# EAGLE design MoteWatch Vers 2 (EAGLE 6.1)
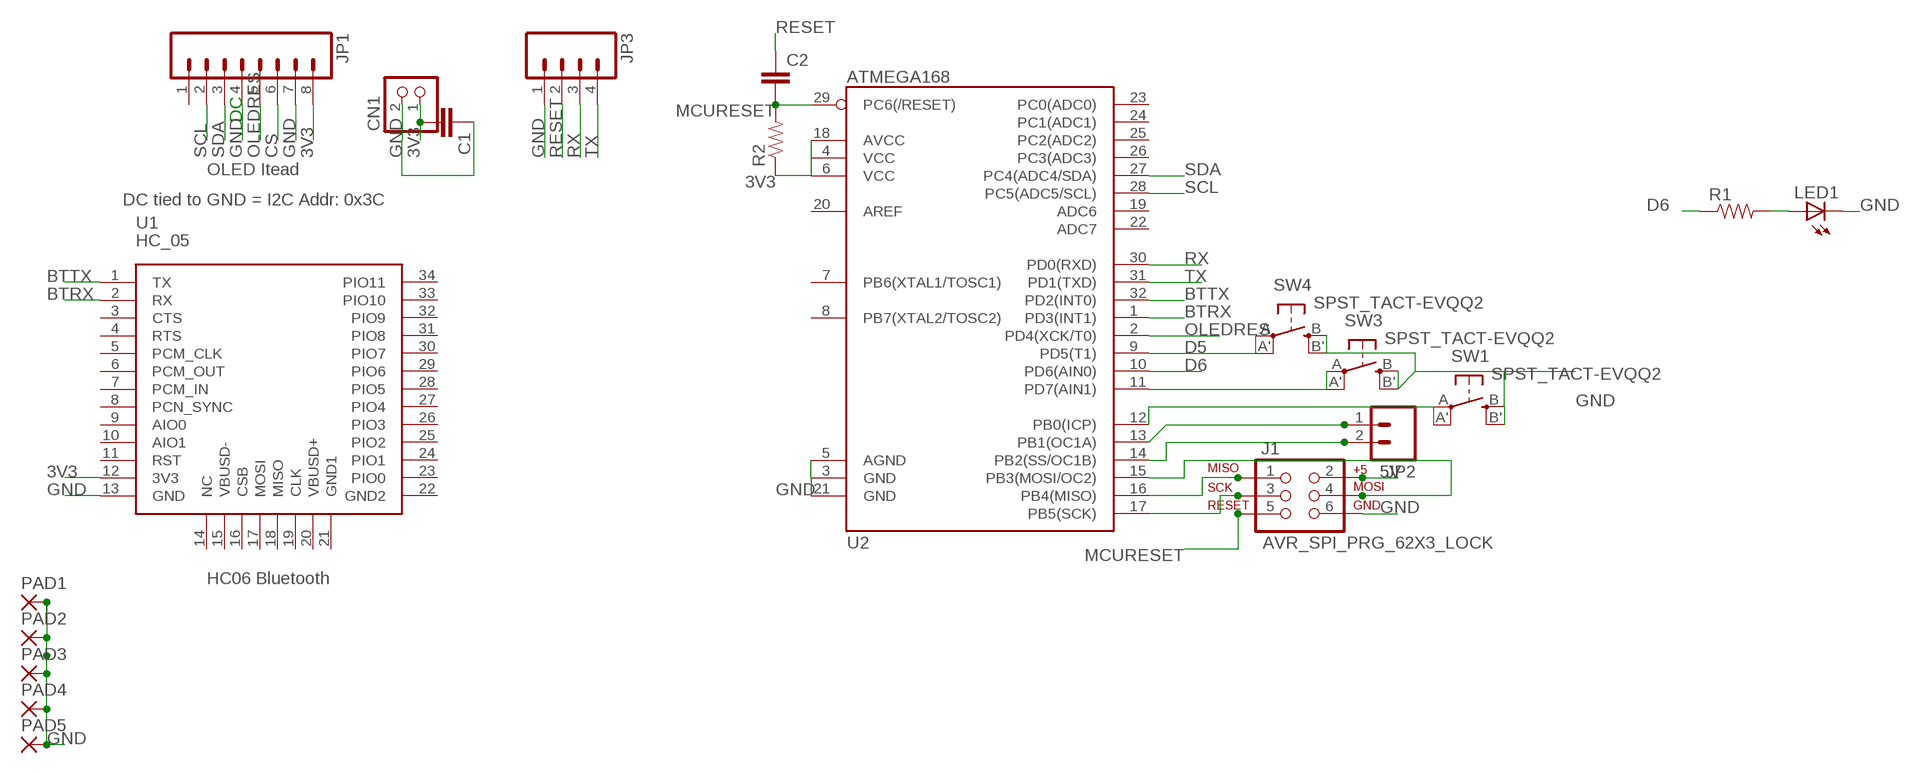
[diagram p0: schematic, sheet 1]

## Parts
C1  CAP1206  [1206]
C2  CAP1206  [1206]
CN1  JST_2PIN-THM-RA  [JST-PH-2-THM-RA]
J1  AVR_SPI_PRG_62X3_LOCK  [2X3_LOCK]
JP1  M08LOCK  [1X08_LOCK]
JP2  M02LOCK  [1X02_LOCK]
JP3  M04PTH  [1X04]
LED1  LED1206  [LED-1206]
PAD1  SMD5  [SMD2,54-5,08]
PAD2  SMD5  [SMD2,54-5,08]
PAD3  SMD5  [SMD2,54-5,08]
PAD4  SMD5  [SMD2,54-5,08]
PAD5  SMD5  [SMD2,54-5,08]
R1  RESISTOR1206  [1206]
R2  RESISTOR1206  [1206]
SW1  SPST_TACT-EVQQ2  [EVQ-Q2]
SW3  SPST_TACT-EVQQ2  [EVQ-Q2]
SW4  SPST_TACT-EVQQ2  [EVQ-Q2]
U1  HC_05  [BLUETOOTH_SMD]
U2  ATMEGA168  [TQFP32-08]

## Nets
3V3: C1.2 CN1.1 JP1.8 R2.1 U1.12(3V3) U2.4(VCC) U2.6(VCC) U2.18(AVCC)
5V: J1.2
BTRX: U1.2(RX) U2.1(PD3(INT1))
BTTX: U1.1(TX) U2.32(PD2(INT0))
CS: JP1.6
D5: SW4.A'(P1) SW4.A(P) U2.9(PD5(T1))
D6: R1.1 U2.10(PD6(AIN0))
D7: SW3.A'(P1) SW3.A(P) U2.11(PD7(AIN1))
D8: SW1.A'(P1) SW1.A(P) U2.12(PB0(ICP))
D9: JP2.1 U2.13(PB1(OC1A))
D10: JP2.2 U2.14(PB2(SS/OC1B))
GND: C1.1 CN1.2 J1.6 JP1.4 JP1.7 JP3.1 LED1.C PAD1.1(P) PAD2.1(P) PAD3.1(P) PAD4.1(P) PAD5.1(P) SW1.B'(S1) SW1.B(S) SW3.B'(S1) SW3.B(S) SW4.B'(S1) SW4.B(S) U1.13(GND) U2.3(GND) U2.5(AGND) U2.21(GND)
MCURESET: C2.2 J1.5 R2.2 U2.29(PC6(/RESET))
MISO: J1.1 U2.16(PB4(MISO))
MOSI: J1.4 U2.15(PB3(MOSI/OC2))
N$2: LED1.A R1.2
OLEDRES: JP1.5 U2.2(PD4(XCK/T0))
RESET: C2.1 JP3.2
RX: JP3.3 U2.30(PD0(RXD))
SCK: J1.3 U2.17(PB5(SCK))
SCL: JP1.2 U2.28(PC5(ADC5/SCL))
SDA: JP1.3 U2.27(PC4(ADC4/SDA))
TX: JP3.4 U2.31(PD1(TXD))
Unconnected: JP1.1 U1.3(CTS) U1.4(RTS) U1.5(PCM_CLK) U1.6(PCM_OUT) U1.7(PCM_IN) U1.8(PCN_SYNC) U1.9(AIO0) U1.10(AIO1) U1.11(RST) U1.14(NC) U1.15(VBUSD-) U1.16(CSB) U1.17(MOSI) U1.18(MISO) U1.19(CLK) U1.20(VBUSD+) U1.21(GND1) U1.22(GND2) U1.23(PIO0) U1.24(PIO1) U1.25(PIO2) U1.26(PIO3) U1.27(PIO4) U1.28(PIO5) U1.29(PIO6) U1.30(PIO7) U1.31(PIO8) U1.32(PIO9) U1.33(PIO10) U1.34(PIO11) U2.7(PB6(XTAL1/TOSC1)) U2.8(PB7(XTAL2/TOSC2)) U2.19(ADC6) U2.20(AREF) U2.22(ADC7) U2.23(PC0(ADC0)) U2.24(PC1(ADC1)) U2.25(PC2(ADC2)) U2.26(PC3(ADC3))

## Notes on the sheet
- DC
- OLED Itead
- DC tied to GND = I2C Addr: 0x3C
- HC06 Bluetooth

## Library data of the parts
C1 C2 = SparkFun-Passives:CAP: Capacitor Standard 0603 ceramic capacitor, and 0.1" leaded capacitor.
CN1 = adafruit:JST_2PIN: JST 2-Pin Connectors of various flavors SMT-RA (S2B-PH-SM4) 4UConnector #17311 SMT (B2B-PH-SM4) THM-RA (S2B-PH) THM (B2B-PH)
J1 = SparkFun-Connectors:AVR_SPI_PRG_6: AVR ISP 6 Pin This is the reduced ISP connector for AVR programming. Common on Arduino. This footprint will take up less PCB space and can be used with a 10-pin to 6-pin adapter such as SKU: BOB-08508
JP1 = SparkFun-Connectors:M08: Header 8 Standard 8-pin 0.1" header. Use with straight break away headers (SKU : PRT-00116), right angle break away headers (PRT-00553), swiss pins (PRT-00743), machine pins (PRT-00117), and female headers (PRT-00115).
JP2 = SparkFun-Connectors:M02: Header 2 Standard 2-pin 0.1" header. Use with straight break away headers (SKU : PRT-00116), right angle break away headers (PRT-00553), swiss pins (PRT-00743), machine pins (PRT-00117), and female headers (PRT-00115). Molex polarized connector foot print use with SKU : PRT-08233 with associated crimp pins and housings.
JP3 = SparkFun-Connectors:M04: Header 4 Standard 4-pin 0.1" header. Use with straight break away headers (SKU : PRT-00116), right angle break away headers (PRT-00553), swiss pins (PRT-00743), machine pins (PRT-00117), and female headers (PRT-00115). Molex polarized connector foot print use with SKU : PRT-08231 with associated crimp pins and housings. 1MM SMD Version SKU: PRT-10208
LED1 = LilyPad-Wearables:LED: LEDs Standard schematic elements and footprints for 5mm, 3mm, 1206, and 0603 sized LEDs. 5mm - Spark Fun Electronics SKU : Comp-SBL
PAD1-PAD5 = wirepad:SMD5: SMD PAD
R1 R2 = SparkFun-Passives:RESISTOR: Resistor Basic schematic elements and footprints for 0603, 1206, and PTH resistors.
SW1 SW3 SW4 = adafruit:SPST_TACT: SMT 6mm switch, EVQQ2 series http://www.ladyada.net/library/eagle
U1 = SerialPortBluetooth:HC_05
U2 = SparkFun-DigitalIC:ATMEGA168: Atmel 32-pin 8-bit micro, 16k flash.

## Board
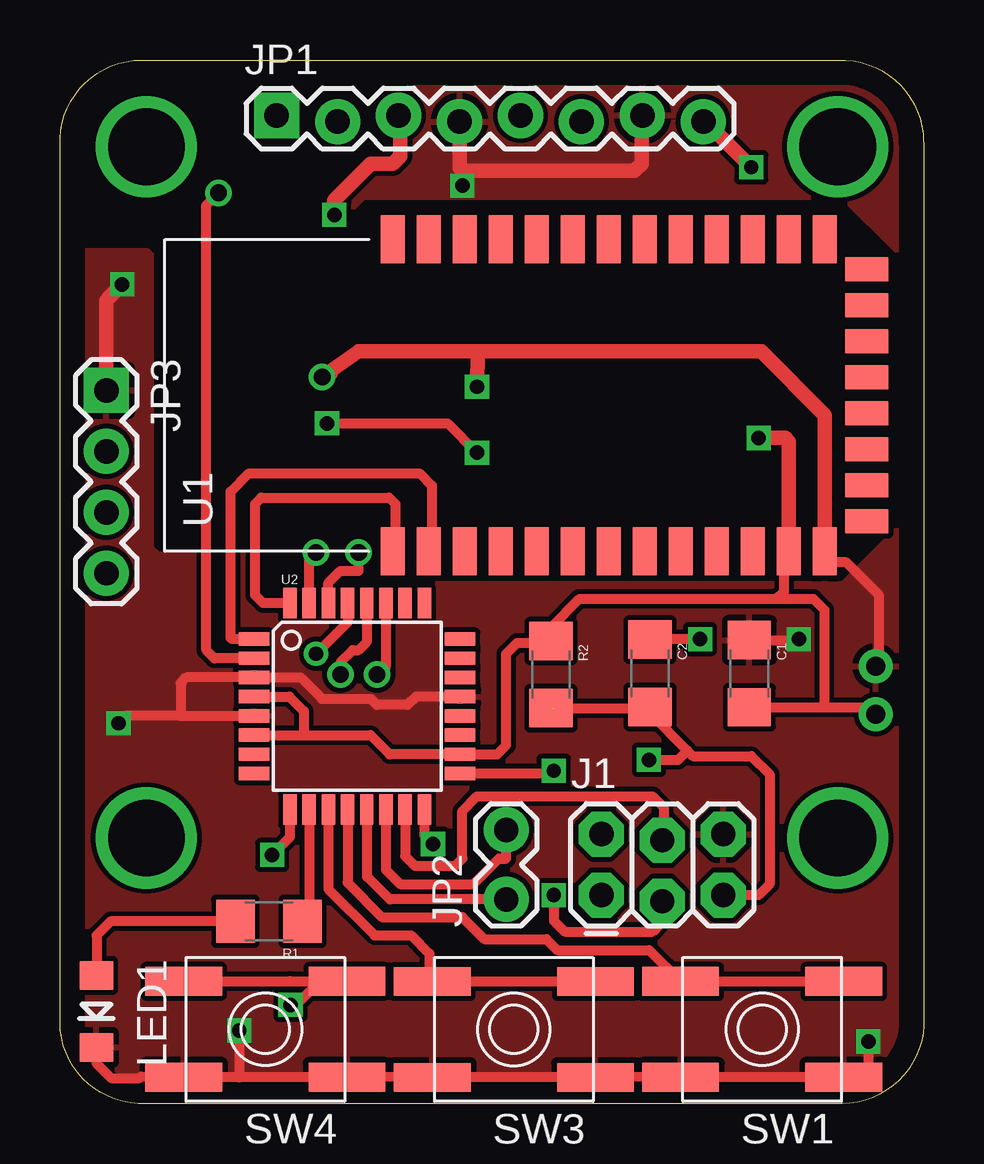
[diagram p1: board, top side]
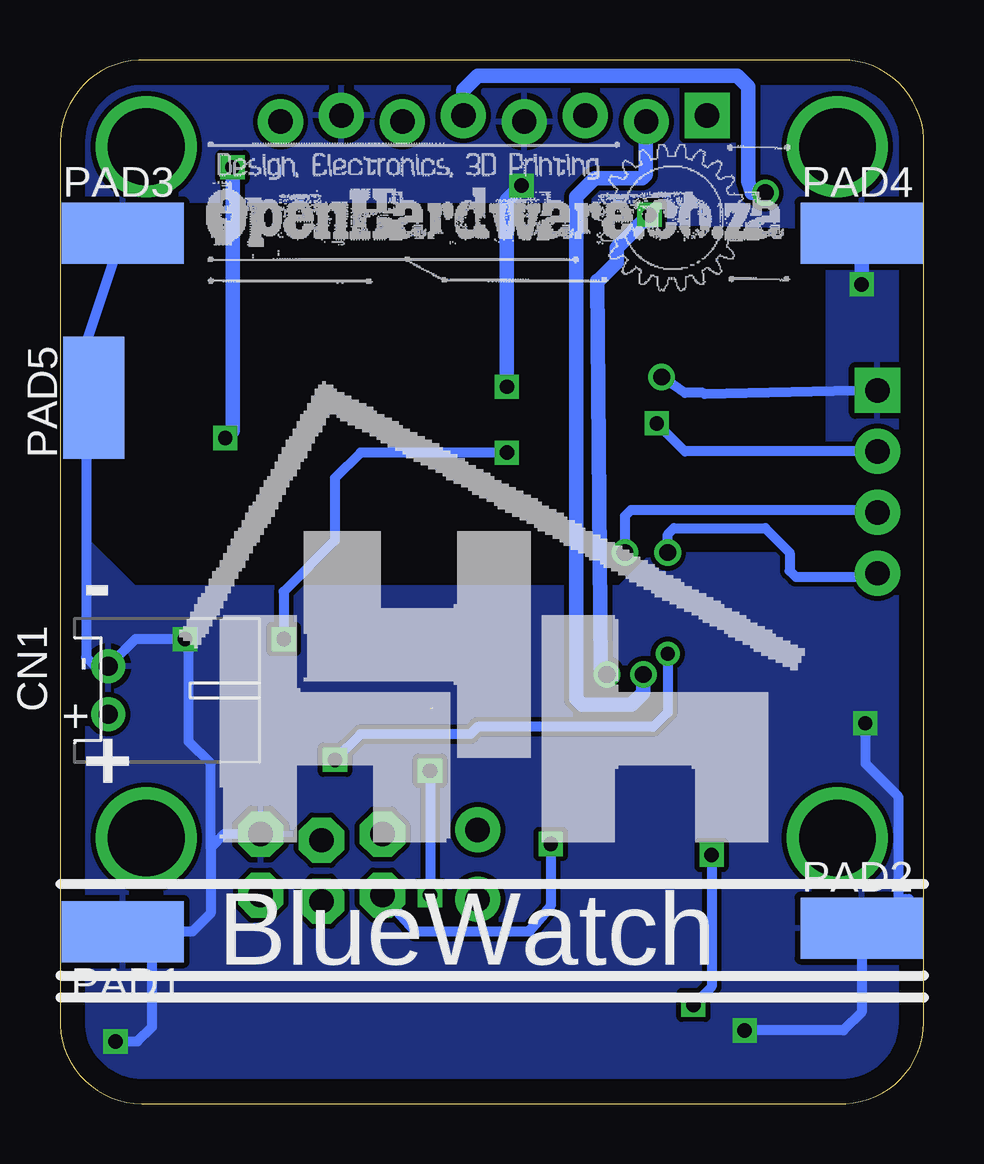
[diagram p2: board, bottom side, seen from below]

Size 35.99 x 43.49 mm. Coordinates in mm from the lower left corner, seen from the top.
Outline: 0,39.9 arc-92 3.4,43.49 32.41,43.49
Outline: 0,39.93 0,3.38 arc92 3.58,0 32.59,0 arc92 35.99,3.58 35.99,40.06
Outline: 32.39,43.48 arc-92 35.98,40.08
Copper layers (1*16): Top 0.035mm / dielectric 1.5mm / Bottom 0.035mm
Design rules "default": minimum track width 10mil, minimum drill 24mil, track to track 8mil, track to pad 8mil, pad to pad 8mil, via to via 8mil, smd to smd 8mil, copper to edge 40mil, drill to drill 8mil, minimum pad ring 10mil, minimum via ring 8mil, stop-mask expansion 4mil, vias tented up to drill 0mil, thermal gap 10mil

### Footprints (pad centres in the part's own frame; a part is rotated, then mirrored left to right if it is on the bottom)
1206 = smd 1.6 x 1.8: 1 -1.4,0; 2 1.4,0
JST-PH-2-THM-RA = drill 0.8 pad 1.422: 1 1,0; 2 -1,0
2X3_LOCK = drill 1.016 pad 1.88 octagon: 1 0,0; 2 0,2.54; 3 2.54,-0.254; 4 2.54,2.286; 5 5.08,0; 6 5.08,2.54
1X08_LOCK = drill 1.016 pad 1.88 square: 1 0,0.127 | drill 1.016 pad 1.88: 2 2.54,-0.127; 3 5.08,0.127; 4 7.62,-0.127; 5 10.16,0.127; 6 12.7,-0.127; 7 15.24,0.127; 8 17.78,-0.127
1X02_LOCK = drill 1.016 pad 1.88: 1 -0.178,0; 2 2.718,0
1X04 = drill 1.016 pad 1.88 square: 1 0,0 | drill 1.016 pad 1.88: 2 2.54,0; 3 5.08,0; 4 7.62,0
LED-1206 = smd 1.2 x 1.4: A -1.5,0; C 1.5,0
SMD2,54-5,08 = smd 2.54 x 5.08: 1 0,0
EVQ-Q2 = smd 3.2 x 1.2: A -3.4,-2; A' 3.4,-2; B -3.4,2; B' 3.4,2
BLUETOOTH_SMD = smd 2 x 1: 1 0,0; 2 0,-1.5; 3 0,-3; 4 0,-4.5; 5 0,-6; 6 0,-7.5; 7 0,-9; 8 0,-10.5; 9 0,-12; 10 0,-13.5; 11 0,-15; 12 0,-16.5; 13 0,-18; 22 13,-18; 23 13,-16.5; 24 13,-15; 25 13,-13.5; 26 13,-12; 27 13,-10.5; 28 13,-9; 29 13,-7.5; 30 13,-6; 31 13,-4.5; 32 13,-3; 33 13,-1.5; 34 13,0 | smd 1 x 1.8: 14 1.25,-19.75; 15 2.75,-19.75; 16 4.25,-19.75; 17 5.75,-19.75; 18 7.25,-19.75; 19 8.75,-19.75; 20 10.25,-19.75; 21 11.75,-19.75
TQFP32-08 = smd 1.27 x 0.559: 1 -4.293,2.8; 2 -4.293,2; 3 -4.293,1.2; 4 -4.293,0.4; 5 -4.293,-0.4; 6 -4.293,-1.2; 7 -4.293,-2; 8 -4.293,-2.8; 17 4.293,-2.8; 18 4.293,-2; 19 4.293,-1.2; 20 4.293,-0.4; 21 4.293,0.4; 22 4.293,1.2; 23 4.293,2; 24 4.293,2.8 | smd 0.559 x 1.27: 9 -2.8,-4.293; 10 -2,-4.293; 11 -1.2,-4.293; 12 -0.4,-4.293; 13 0.4,-4.293; 14 1.2,-4.293; 15 2,-4.293; 16 2.8,-4.293; 25 2.8,4.293; 26 2,4.293; 27 1.2,4.293; 28 0.4,4.293; 29 -0.4,4.293; 30 -1.2,4.293; 31 -2,4.293; 32 -2.8,4.293

### Placement (x,y rotation side)
C1  28.72,17.92 270 top
C2  24.59,17.93 270 top
CN1  33.99,17.22 270 bottom
J1  22.56,8.69 0 top
JP1  9.03,41.05 0 top
JP2  18.59,8.69 90 top
JP3  1.93,29.72 270 top
LED1  1.52,3.84 270 top
PAD1  33.38,7.16 90 bottom
PAD2  2.59,7.32 270 bottom
PAD3  33.38,36.27 270 bottom
PAD4  2.59,36.27 270 bottom
PAD5  34.59,29.41 0 bottom
R1  8.71,7.6 180 top
R2  20.46,17.88 270 top
SW1  29.26,3.1 180 top
SW3  18.91,3.09 180 top
SW4  8.56,3.1 180 top
U1  13.87,23.01 90 top
U2  12.38,16.56 0 top

### Tracks (layer width: path | path; a pad name or v marks a point on that pad's centre or on a via)
3V3  (via drill 0.6)
  Top 0.406: U2.6 10.16,15.36 | 10.16,15.36 12.94,15.36 13.74,14.56 U2.18 18.21,14.56 18.59,14.94 18.59,18.75 19.05,19.2 20.38,19.2 R2.1 20.46,19.85 21.64,21.03 29.87,21.03 | U2.4 9.56,16.96 10.16,16.36 10.16,15.36 | 29.87,21.03 30.17,21.34 30.17,22.81 U1.12 | C1.2 31.7,16.52 | 31.7,16.52 33.69,16.52 CN1.1 | 29.87,21.03 31.39,21.03 31.85,20.58 31.85,16.67 31.7,16.52
  Top 0.61: U1.12 30.37,27.54 30.37,27.59 30.22,27.74 v29.11,27.74 | JP1.8 27.51,40.31 v28.8,39.02
  Bottom 0.61: v28.8,39.02 28.8,28.04 v29.11,27.74
BTRX
  Top 0.406: U2.1 7.16,19.36 7.11,19.41 7.11,25.5 7.87,26.26 14.99,26.26 15.49,25.76 15.49,23.13
  Top 0.61: 15.49,23.13 U1.2
BTTX
  Top 0.406: U2.32 8.46,20.85 8.13,21.18 8.13,24.99 8.38,25.25 13.72,25.25 13.97,24.99 13.97,23.11
  Top 0.61: 13.97,23.11 U1.1
D5  (via drill 0.6)
  Top 0.406: SW4.A' 9.6,5.1 | 9.6,5.1 10.82,5.1 | 10.82,5.1 SW4.A | 9.58,5.12 9.6,5.1 | U2.9 9.58,11.11 v8.84,10.36 | v9.6,4.12 9.84,4.12 10.82,5.1
  Bottom 0.406: v8.84,10.36 8.84,4.88 v9.6,4.12
D6
  Top 0.406: U2.10 10.38,7.87 R1.1
D7
  Top 0.406: SW3.A SW3.A' 15.39,5.21 15.39,6.25 14.63,7.01 13.11,7.01 11.18,8.94 U2.11
D8
  Top 0.406: SW1.A SW1.A' 24.55,6.4 20.73,6.4 20.27,6.86 17.68,6.86 16.76,7.77 13.41,7.77 11.98,9.2 U2.12
D9
  Top 0.406: JP2.1 13.74,8.51 12.8,9.45 12.8,12.24 U2.13
D10
  Top 0.406: U2.14 13.58,9.74 14.17,9.15 17.22,9.15 18.29,10.21 18.59,10.21 JP2.2
GND  (via drill 0.6, 0.7)
  Top 0.406: SW3.B' SW3.B 22.67,1.12 SW1.B' SW1.B 33.71,1.12 33.71,2.56 v33.68,2.59 | SW3.B' 15.37,1.12 15.29,1.19 15.79,1.19 SW3.B' | SW3.B' 12.42,1.12 SW4.B 7.47,1.1 | 7.47,1.1 SW4.B' 3.37,1.13 3.31,1.07 2.13,1.07 1.52,1.69 LED1.C | U1.13 32.32,22.56 32.77,22.56 34.11,21.21 34.11,18.35 CN1.2 34.13,18.08 | U2.21 14.82,16.96 14.48,16.61 13.21,16.61 12.95,16.87 10.92,16.87 10.03,17.76 U2.3 5.26,17.76 5.03,17.53 5.03,16.16 | v7.47,3.05 7.47,1.1 | 5.03,16.16 U2.5 | C1.1 30.59,19.32 v30.78,19.36 | 5.03,16.16 2.74,16.16 v2.44,15.85
  Top 0.61: U1.13 31.87,28.68 29.21,31.34 17.42,31.34 | 11.28,30.43 v10.92,30.28 12.45,31.34 17.42,31.34 | JP1.4 16.65,38.98 16.76,38.86 | 16.76,38.86 16.92,38.86 | 16.92,38.86 23.93,38.86 24.23,39.17 24.23,40.53 JP1.7 | 16.76,38.86 v16.76,38.25 16.76,38.71 16.92,38.86 | 17.42,31.34 v17.37,29.87 | JP3.1 1.93,33.43 1.98,33.53 v2.59,34.14
  Bottom 0.406: JP3.1 9.14,29.57 9.19,29.62 9.96,29.62 v10.92,30.28 | v7.47,3.05 3.35,3.05 2.59,3.81 PAD2.1 1.83,7.32 0.69,8.46 | J1.6 29.16,11.23 29.72,10.67 | 29.72,10.67 29.72,7.93 30.48,7.16 32.31,7.16 | 32.31,7.16 33.22,7.16 33.38,7.01 PAD1.1 34.75,7.16 | PAD3.1 34.9,31.7 | 34.9,31.7 PAD5.1 | 34.9,31.7 34.9,18.59 34.53,18.22 CN1.2 32.85,19.36 v30.78,19.36 30.63,19.2 30.63,15.09 29.72,14.17 29.72,10.67 | v2.44,15.85 2.44,14.17 1.07,12.8 1.07,8.23 0.76,7.93 0.76,8.23 0.61,8.38 0.69,8.46 | 0.69,8.46 0.76,8.54 | 0.61,8.54 0.69,8.46 | v33.68,2.59 32.77,2.59 32.16,3.2 32.16,7.01 32.31,7.16
  Bottom 0.61: v17.37,29.87 17.37,37.64 v16.76,38.25 | v2.59,34.14 PAD4.1
  pour Bottom: -0.15,36.42 11.43,36.73 12.34,37.64 33.22,37.64 35.2,35.66 35.2,23.78 32.92,21.49 12.65,21.49 11.28,22.86 4.11,22.86 3.96,22.71 3.96,35.81 0.15,35.81 0,35.66 0,1.98 2.29,-0.3 33.83,-0.3 36.12,1.98 36.12,41.76 33.99,43.89 2.13,43.89 -0.46,41.3 -0.15,37.49 -0.3,37.34 -0.15,36.73
  pour Top: 0,36.42 11.43,36.58 12.65,37.8 32.61,37.8 34.9,35.51 34.9,23.93 32.61,21.64 13.11,21.64 12.65,22.1 12.65,22.71 12.5,22.86 4.11,22.86 3.81,23.17 3.81,35.36 3.66,35.51 0.46,35.51 0,35.05 0,1.52 1.83,-0.3 33.68,-0.3 36.27,2.29 36.27,41.3 33.83,43.74 1.98,43.74 -0.3,41.45 0,37.8
MCURESET  (via drill 0.6)  (1 unrouted)
  Top 0.406: U2.29 11.98,20.06 v10.67,18.75 | R2.2 24.53,16.48 C2.2 24.59,16.26 26.14,14.71 | 26.14,14.71 26.36,14.48 28.8,14.48 29.57,13.72 29.57,9.15 29.11,8.69 J1.5 | v24.54,14.33 25.76,14.33 26.14,14.71 | 20.57,16.46 20.57,16.31 20.73,16.46 20.57,16.61 20.57,16.46
  Bottom 0.406: v10.67,18.75 10.67,16.31 11.28,15.7 18.59,15.7 18.9,15.39 23.47,15.39 v24.54,14.33
MISO  (via drill 0.6)
  Top 0.406: U2.16 15.18,11.19 v15.54,10.82
  Bottom 0.406: v15.54,10.82 15.54,8.23 16.46,7.16 21.18,7.16 J1.1
MOSI
  Top 0.406: U2.15 14.38,10.31 14.78,9.91 16.46,9.91 16.76,10.21 16.76,12.19 17.37,12.8 24.69,12.8 25.15,12.35 25.15,11.02 J1.4
N$2
  Top 0.406: R1.2 2.11,7.6 1.52,7.01 LED1.A
N$6  (via drill 3.2)
  other vias: 3.6,11.07
N$7  (via drill 3.2)
  other vias: 32.4,11.07
N$8  (via drill 3.2)
  other vias: 32.4,39.87
N$9  (via drill 3.2)
  other vias: 3.6,39.87
OLEDRES  (via drill 0.7)
  Top 0.406: U2.2 6.44,18.56 6.1,18.9 6.1,37.44 v6.6,37.95
  Bottom 0.61: v6.6,37.95 7.16,37.95 7.31,38.41 7.31,42.37 7.77,42.83 18.59,42.83 19.19,42.23 JP1.5
RESET  (via drill 0.6)
  Top 0.406: v11.12,28.35 16.15,28.35 v17.37,27.13 | v26.67,19.36 24.61,19.36 C2.1
  Bottom 0.406: JP3.2 9.96,27.18 v11.12,28.35 | v17.37,27.13 23.47,27.13 24.54,26.06 24.54,23.47 26.67,21.34 v26.67,19.36
RX  (via drill 0.7)
  Top 0.406: U2.30 11.18,21.7 11.68,22.2 12.45,22.2 v12.45,22.96
  Bottom 0.406: v12.45,22.96 12.45,24.49 12.19,24.74 2.03,24.74 JP3.3
SCK  (via drill 0.6)
  Top 0.406: U2.17 20.31,13.76 v20.57,13.87 | v20.57,8.69 20.57,7.62 21.03,7.16 24.69,7.16 24.99,7.47 24.99,8.33 J1.3
  Bottom 0.406: v20.57,13.87 v20.57,8.69
SCL  (via drill 0.7)
  Top 0.406: v11.68,17.88 11.68,18.39 12.19,18.9 12.45,18.9 12.78,19.23 U2.28
  Bottom 0.61: v11.68,17.88 11.68,17.12 12.19,16.61 14.22,16.61 14.48,16.87 14.48,37.8 13.72,38.56 11.73,38.56 11.58,38.71 11.58,40.29 JP1.2
SDA  (via drill 0.6, 0.7)
  Top 0.406: U2.27 13.58,18.25 v13.21,17.88
  Top 0.61: v13.21,17.88 13.46,18.14 | v11.43,37.03 11.43,37.64 12.95,39.17 13.87,39.17 14.17,39.47 14.17,40.5 JP1.3
  Bottom 0.61: v13.21,17.88 13.46,18.14 13.61,34.29 13.56,34.29 12.8,35.05 12.8,35.66 v11.43,37.03
TX  (via drill 0.7)
  Top 0.406: U2.31 10.38,22.67 v10.67,22.96
  Bottom 0.406: v10.67,22.96 10.67,23.72 10.41,23.98 6.6,23.98 5.59,22.96 5.59,22.2 5.33,21.95 2.08,21.95 JP3.4

### Text on the board
bPlace: - | + | BlueWatch
OPENHWSILK: OLED | NC | SCL | SDA | DC | D4 | N/C | GND | 3.3V | HC06 Bluetooth | GND | RES | RX | TX | SERIAL | - | 10K | 0.1u | 0.1u | ATMega328 | GND | MOSI | + | SPI | D10 | 1K | D9 | MISO | SCK | RST | D6